# Altium schematic sheet FPGA_B35.SchDoc: HM-CORE FPGA B35
size A4; PageSetup: Record=PageOptions|CenterHorizontal=True|CenterVertical=True|PrintScale=0.96|XCorrection=1.00|YCorrection=1.00|PrintKind=0|BorderSize=5000000|LeftOffset=0|BottomOffset=0|Orientation=2|PaperLength=1000|PaperWidth=1000|Scale=100|PaperSource=7|PrintQuality=-4|MediaType=1|DitherType=10|PaperKind=A4|PrintScaleMode=1; Organization: Trenz Electronic GmbH; Revision: A; SheetNumber: 3; SheetTotal: 12; Date: 08.07.2015; Author: Indrek Tubalkain; CompanyName: Trenz Electronic GmbH; DrawnBy: Indrek Tubalkain; Engineer: Indrek Tubalkain; ProjectName: TE0723 Arduino
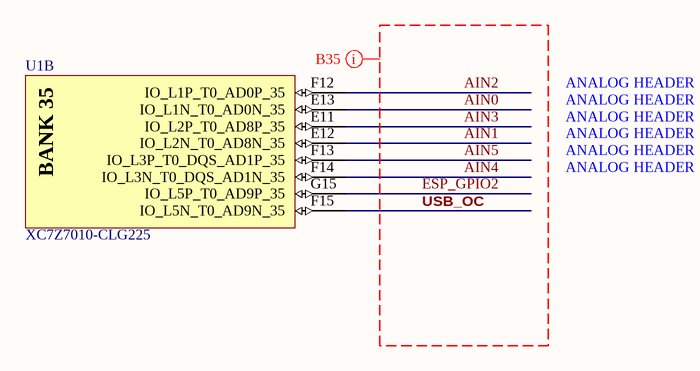
[diagram p0: FPGA_B35.SchDoc]

## Parts
U1  XC7Z7010-CLG225  (part B of 8)

## Nets
AIN0: U1.E13(IO_L1N_T0_AD0N_35)
AIN1: U1.E12(IO_L2N_T0_AD8N_35)
AIN2: U1.F12(IO_L1P_T0_AD0P_35)
AIN3: U1.E11(IO_L2P_T0_AD8P_35)
AIN4: U1.F14(IO_L3N_T0_DQS_AD1N_35)
AIN5: U1.F13(IO_L3P_T0_DQS_AD1P_35)
ESP_GPIO2: U1.G15(IO_L5P_T0_AD9P_35)
USB_OC: U1.F15(IO_L5N_T0_AD9N_35)

## Layout directives
net class B35: AIN0, AIN1, AIN2, AIN3, AIN4, AIN5, ESP_GPIO2, USB_OC

## Notes on the sheet
- ANALOG HEADER
- Name:
- Size:
- A4
- Number:
- Revision:
- Designed by Trenz Electronic and changed by HMLAB
- OPEN SOURCE HARDWARE
- For more information, please visit: www.hm-lab.com/hm-core <http://hm-lab.com/hm-core>
- Date:
- Time:
- Sheet
- of
- (in symbol XC7Z7010-CLG225, part B) BANK 35